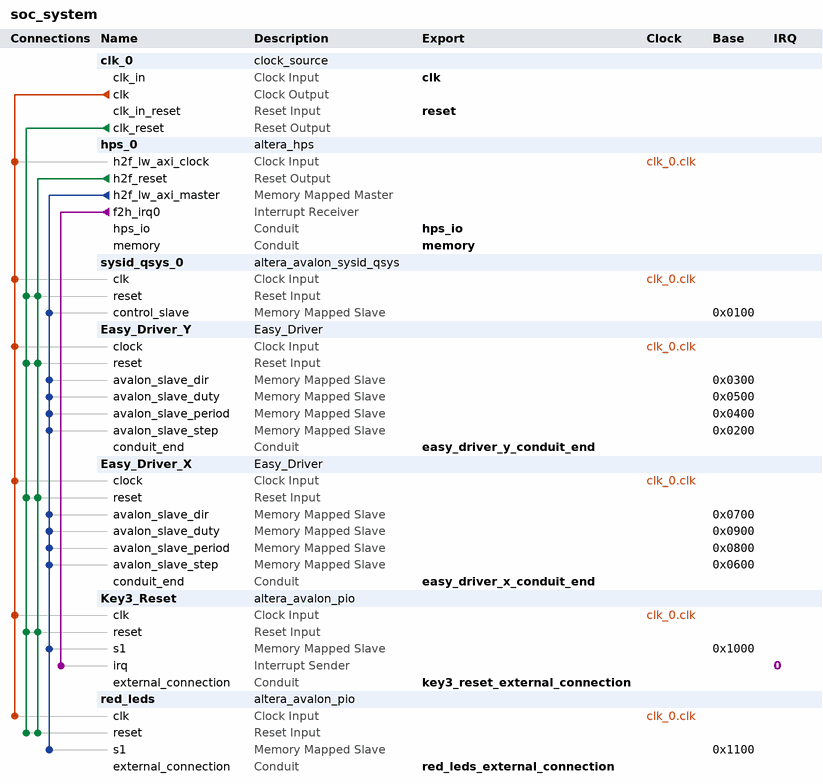
[diagram p0: system contents]
# Platform Designer (Qsys) system soc_system, Cyclone V 5CSEMA5F31C6
# Parameters at their usual value, and those the tool derives, are not listed.
package require -exact qsys 17.0
create_system soc_system
set_project_property DEVICE_FAMILY {Cyclone V}
set_project_property DEVICE 5CSEMA5F31C6

add_instance clk_0 clock_source 17.0
set_instance_parameter_value clk_0 clockFrequency 50000000

add_instance hps_0 altera_hps 17.0
set_instance_parameter_value hps_0 EMAC1_Mode RGMII
set_instance_parameter_value hps_0 EMAC1_PinMuxing {HPS I/O Set 0}
set_instance_parameter_value hps_0 F2SCLK_COLDRST_Enable false
set_instance_parameter_value hps_0 F2SCLK_DBGRST_Enable false
set_instance_parameter_value hps_0 F2SCLK_WARMRST_Enable false
set_instance_parameter_value hps_0 F2SINTERRUPT_Enable true
set_instance_parameter_value hps_0 F2S_Width 0
set_instance_parameter_value hps_0 FPGA_PERIPHERAL_OUTPUT_CLOCK_FREQ_EMAC0_GTX_CLK 125
set_instance_parameter_value hps_0 FPGA_PERIPHERAL_OUTPUT_CLOCK_FREQ_EMAC0_MD_CLK 2.5
set_instance_parameter_value hps_0 FPGA_PERIPHERAL_OUTPUT_CLOCK_FREQ_EMAC1_GTX_CLK 125
set_instance_parameter_value hps_0 FPGA_PERIPHERAL_OUTPUT_CLOCK_FREQ_EMAC1_MD_CLK 2.5
set_instance_parameter_value hps_0 HPS_PROTOCOL DDR3
set_instance_parameter_value hps_0 I2C0_Mode I2C
set_instance_parameter_value hps_0 I2C0_PinMuxing {HPS I/O Set 0}
set_instance_parameter_value hps_0 I2C1_Mode I2C
set_instance_parameter_value hps_0 I2C1_PinMuxing {HPS I/O Set 0}
set_instance_parameter_value hps_0 LWH2F_Enable true
set_instance_parameter_value hps_0 MEM_BANKADDR_WIDTH 3
set_instance_parameter_value hps_0 MEM_CLK_FREQ 400.0
set_instance_parameter_value hps_0 MEM_COL_ADDR_WIDTH 10
set_instance_parameter_value hps_0 MEM_DQ_WIDTH 32
set_instance_parameter_value hps_0 MEM_DRV_STR RZQ/7
set_instance_parameter_value hps_0 MEM_ROW_ADDR_WIDTH 15
set_instance_parameter_value hps_0 MEM_RTT_NOM RZQ/4
set_instance_parameter_value hps_0 MEM_RTT_WR RZQ/4
set_instance_parameter_value hps_0 MEM_TCL 11
set_instance_parameter_value hps_0 MEM_TFAW_NS 30.0
set_instance_parameter_value hps_0 MEM_TRAS_NS 35.0
set_instance_parameter_value hps_0 MEM_TRCD_NS 13.75
set_instance_parameter_value hps_0 MEM_TRFC_NS 260.0
set_instance_parameter_value hps_0 MEM_TRP_NS 13.75
set_instance_parameter_value hps_0 MEM_VENDOR Other
set_instance_parameter_value hps_0 MEM_WTCL 8
set_instance_parameter_value hps_0 QSPI_Mode N/A
set_instance_parameter_value hps_0 QSPI_PinMuxing Unused
set_instance_parameter_value hps_0 REF_CLK_FREQ 25.0
set_instance_parameter_value hps_0 S2FCLK_USER2CLK 5
set_instance_parameter_value hps_0 S2F_Width 0
set_instance_parameter_value hps_0 SDIO_Mode {4-bit Data}
set_instance_parameter_value hps_0 SDIO_PinMuxing {HPS I/O Set 0}
set_instance_parameter_value hps_0 SPIM1_Mode {Single Slave Select}
set_instance_parameter_value hps_0 SPIM1_PinMuxing {HPS I/O Set 0}
set_instance_parameter_value hps_0 STM_Enable false
set_instance_parameter_value hps_0 TIMING_BOARD_AC_SKEW 0.02
set_instance_parameter_value hps_0 TIMING_BOARD_AC_TO_CK_SKEW 0.01
set_instance_parameter_value hps_0 TIMING_BOARD_DQ_TO_DQS_SKEW 0.05
set_instance_parameter_value hps_0 TIMING_BOARD_MAX_CK_DELAY 0.03
set_instance_parameter_value hps_0 TIMING_BOARD_MAX_DQS_DELAY 0.02
set_instance_parameter_value hps_0 TIMING_BOARD_SKEW_BETWEEN_DQS 0.06
set_instance_parameter_value hps_0 TIMING_BOARD_SKEW_CKDQS_DIMM_MAX 0.12
set_instance_parameter_value hps_0 TIMING_BOARD_SKEW_CKDQS_DIMM_MIN 0.06
set_instance_parameter_value hps_0 TIMING_BOARD_SKEW_WITHIN_DQS 0.01
set_instance_parameter_value hps_0 TIMING_TDH 65
set_instance_parameter_value hps_0 TIMING_TDQSCK 255
set_instance_parameter_value hps_0 TIMING_TDQSQ 125
set_instance_parameter_value hps_0 TIMING_TDS 30
set_instance_parameter_value hps_0 TIMING_TIH 140
set_instance_parameter_value hps_0 TIMING_TIS 180
set_instance_parameter_value hps_0 TIMING_TQSH 0.4
set_instance_parameter_value hps_0 UART0_Mode {No Flow Control}
set_instance_parameter_value hps_0 UART0_PinMuxing {HPS I/O Set 0}
set_instance_parameter_value hps_0 USB1_Mode SDR
set_instance_parameter_value hps_0 USB1_PinMuxing {HPS I/O Set 0}
set_instance_parameter_value hps_0 desired_cfg_clk_mhz 100.0
set_instance_parameter_value hps_0 desired_qspi_clk_mhz 400.0
set_instance_parameter_value hps_0 use_default_mpu_clk false

add_instance sysid_qsys_0 altera_avalon_sysid_qsys 17.0
set_instance_parameter_value sysid_qsys_0 id 0

add_instance Easy_Driver_Y Easy_Driver 1.0

add_instance Easy_Driver_X Easy_Driver 1.0

add_instance Key3_Reset altera_avalon_pio 17.0
set_instance_parameter_value Key3_Reset captureEdge true
set_instance_parameter_value Key3_Reset direction Input
set_instance_parameter_value Key3_Reset edgeType FALLING
set_instance_parameter_value Key3_Reset generateIRQ true
set_instance_parameter_value Key3_Reset irqType EDGE
set_instance_parameter_value Key3_Reset width 1

add_instance red_leds altera_avalon_pio 17.0
set_instance_parameter_value red_leds direction Output
set_instance_parameter_value red_leds width 10

# connections
add_connection clk_0.clk Easy_Driver_X.clock clock
add_connection clk_0.clk Easy_Driver_Y.clock clock
add_connection clk_0.clk hps_0.h2f_lw_axi_clock clock
add_connection clk_0.clk Key3_Reset.clk clock
add_connection clk_0.clk red_leds.clk clock
add_connection clk_0.clk sysid_qsys_0.clk clock
add_connection clk_0.clk_reset Easy_Driver_X.reset reset
add_connection clk_0.clk_reset Easy_Driver_Y.reset reset
add_connection clk_0.clk_reset Key3_Reset.reset reset
add_connection clk_0.clk_reset red_leds.reset reset
add_connection clk_0.clk_reset sysid_qsys_0.reset reset
add_connection hps_0.h2f_reset Easy_Driver_X.reset reset
add_connection hps_0.h2f_reset Easy_Driver_Y.reset reset
add_connection hps_0.h2f_reset Key3_Reset.reset reset
add_connection hps_0.h2f_reset red_leds.reset reset
add_connection hps_0.h2f_reset sysid_qsys_0.reset reset
add_connection hps_0.h2f_lw_axi_master Easy_Driver_X.avalon_slave_dir avalon
set_connection_parameter_value hps_0.h2f_lw_axi_master/Easy_Driver_X.avalon_slave_dir baseAddress 0x0700
add_connection hps_0.h2f_lw_axi_master Easy_Driver_X.avalon_slave_duty avalon
set_connection_parameter_value hps_0.h2f_lw_axi_master/Easy_Driver_X.avalon_slave_duty baseAddress 0x0900
add_connection hps_0.h2f_lw_axi_master Easy_Driver_X.avalon_slave_period avalon
set_connection_parameter_value hps_0.h2f_lw_axi_master/Easy_Driver_X.avalon_slave_period baseAddress 0x0800
add_connection hps_0.h2f_lw_axi_master Easy_Driver_X.avalon_slave_step avalon
set_connection_parameter_value hps_0.h2f_lw_axi_master/Easy_Driver_X.avalon_slave_step baseAddress 0x0600
add_connection hps_0.h2f_lw_axi_master Easy_Driver_Y.avalon_slave_dir avalon
set_connection_parameter_value hps_0.h2f_lw_axi_master/Easy_Driver_Y.avalon_slave_dir baseAddress 0x0300
add_connection hps_0.h2f_lw_axi_master Easy_Driver_Y.avalon_slave_duty avalon
set_connection_parameter_value hps_0.h2f_lw_axi_master/Easy_Driver_Y.avalon_slave_duty baseAddress 0x0500
add_connection hps_0.h2f_lw_axi_master Easy_Driver_Y.avalon_slave_period avalon
set_connection_parameter_value hps_0.h2f_lw_axi_master/Easy_Driver_Y.avalon_slave_period baseAddress 0x0400
add_connection hps_0.h2f_lw_axi_master Easy_Driver_Y.avalon_slave_step avalon
set_connection_parameter_value hps_0.h2f_lw_axi_master/Easy_Driver_Y.avalon_slave_step baseAddress 0x0200
add_connection hps_0.h2f_lw_axi_master Key3_Reset.s1 avalon
set_connection_parameter_value hps_0.h2f_lw_axi_master/Key3_Reset.s1 baseAddress 0x1000
add_connection hps_0.h2f_lw_axi_master red_leds.s1 avalon
set_connection_parameter_value hps_0.h2f_lw_axi_master/red_leds.s1 baseAddress 0x1100
add_connection hps_0.h2f_lw_axi_master sysid_qsys_0.control_slave avalon
set_connection_parameter_value hps_0.h2f_lw_axi_master/sysid_qsys_0.control_slave baseAddress 0x0100
add_connection hps_0.f2h_irq0 Key3_Reset.irq interrupt
set_connection_parameter_value hps_0.f2h_irq0/Key3_Reset.irq irqNumber 0

# exported interfaces
add_interface clk clock sink
set_interface_property clk EXPORT_OF clk_0.clk_in
add_interface easy_driver_x_conduit_end conduit end
set_interface_property easy_driver_x_conduit_end EXPORT_OF Easy_Driver_X.conduit_end
add_interface easy_driver_y_conduit_end conduit end
set_interface_property easy_driver_y_conduit_end EXPORT_OF Easy_Driver_Y.conduit_end
add_interface hps_io conduit end
set_interface_property hps_io EXPORT_OF hps_0.hps_io
add_interface key3_reset_external_connection conduit end
set_interface_property key3_reset_external_connection EXPORT_OF Key3_Reset.external_connection
add_interface memory conduit end
set_interface_property memory EXPORT_OF hps_0.memory
add_interface red_leds_external_connection conduit end
set_interface_property red_leds_external_connection EXPORT_OF red_leds.external_connection
add_interface reset reset sink
set_interface_property reset EXPORT_OF clk_0.clk_in_reset

set_interconnect_requirement {$system} qsys_mm.clockCrossingAdapter HANDSHAKE
set_interconnect_requirement {$system} qsys_mm.enableEccProtection FALSE
set_interconnect_requirement {$system} qsys_mm.insertDefaultSlave FALSE
set_interconnect_requirement {$system} qsys_mm.maxAdditionalLatency 1

save_system soc_system.qsys
